# Altium project UWB Wireless Board.PrjPcb
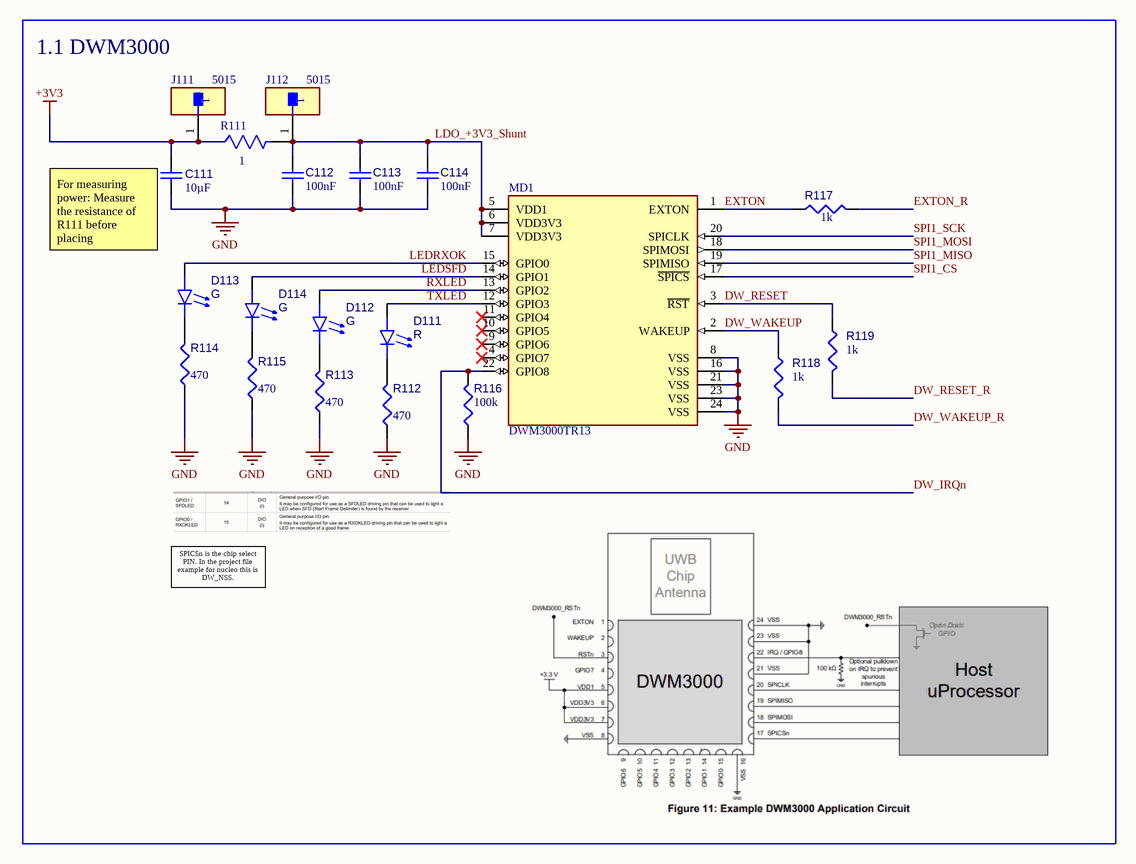
[diagram p0: DWM3000.SchDoc]
4 sheets, 61 parts. Net scope: global (net labels, ports and power ports of the same name join across sheets).
Board file: PCB1.PcbDoc
Sheets:
  DWM3000.SchDoc
  ESP32_S2.SchDoc
  Power Supply.SchDoc
  Peripherals.SchDoc

## Sheet DWM3000.SchDoc
size A4; SheetNumber: 1; SheetTotal: 4

### Parts
C111  value 10µF  [CAPC0603(1608)100_L]  (hidden comment: Capacitor 10µF +/-20% 10V 0603)
C112  value 100nF  [CAPC0402(1005)60_L]  (hidden comment: Capacitor 100nF +/-20% 10V 0402)
C113  value 100nF  [CAPC0402(1005)60_L]  (hidden comment: Capacitor 100nF +/-20% 10V 0402)
C114  value 100nF  [CAPC0402(1005)60_L]  (hidden comment: Capacitor 100nF +/-20% 10V 0402)
D111  R  [WL-SMCW_0603_150060xx75000]
D112  G  [WL-SMCW_0603_150060xx75000]
D113  G  [WL-SMCW_0603_150060xx75000]
D114  G  [WL-SMCW_0603_150060xx75000]
J111  5015  [FP-5015-MFG]
J112  5015  [FP-5015-MFG]
MD1  DWM3000TR13  [FP-DWM3000TR13-MFG]
R111  value 1  [FP-CRCW0603-HPe3-MFG]  (hidden comment: CRCW06031R00FKEAHP)
R112  value 470  [RESC0805(2012)_L]  (hidden comment: Resistor 470R +/-5% 0805 125 mW)
R113  value 470  [RESC0805(2012)_L]  (hidden comment: Resistor 470R +/-5% 0805 125 mW)
R114  value 470  [RESC0805(2012)_L]  (hidden comment: Resistor 470R +/-5% 0805 125 mW)
R115  value 470  [RESC0805(2012)_L]  (hidden comment: Resistor 470R +/-5% 0805 125 mW)
R116  value 100k  [RESC1608X55X25ML10T15]  (hidden comment: Resistor 100k +/-1% 0603 100 mW)
R117  value 1k  [RESC1005X40X25ML10T10]  (hidden comment: Resistor 1k +/-5% 0402 63 mW)
R118  value 1k  [RESC1005X40X25ML10T10]  (hidden comment: Resistor 1k +/-5% 0402 63 mW)
R119  value 1k  [RESC1005X40X25ML10T10]  (hidden comment: Resistor 1k +/-5% 0402 63 mW)

### Blocks framed on the sheet
1.1 DWM3000: C111-C114 D111-D114 J111 J112 MD1 R111-R119

### Nets
+3V3: C111.1 J111.1 R111.1
GND: C111.2 C112.1 C113.1 C114.1 MD1.8(VSS) MD1.16(VSS) MD1.21(VSS) MD1.23(VSS) MD1.24(VSS) R112.1 R113.1 R114.1 R115.1 R116.1
DW_IRQn: MD1.22(GPIO8) R116.2
DW_RESET: MD1.3(~{RST}) R119.1
DW_RESET_R: R119.2
DW_WAKEUP: MD1.2(WAKEUP) R118.1
DW_WAKEUP_R: R118.2
EXTON: MD1.1(EXTON) R117.1
EXTON_R: R117.2
LDO_+3V3_Shunt: C112.2 C113.2 C114.2 J112.1 MD1.5(VDD1) MD1.6(VDD3V3) MD1.7(VDD3V3) R111.2
LEDRXOK: D113.2(A) MD1.15(GPIO0)
LEDSFD: D114.2(A) MD1.14(GPIO1)
RXLED: D112.2(A) MD1.13(GPIO2)
SPI1_CS: MD1.17(~{SPICS})
SPI1_MISO: MD1.19(SPIMISO)
SPI1_MOSI: MD1.18(SPIMOSI)
SPI1_SCK: MD1.20(SPICLK)
TXLED: D111.2(A) MD1.12(GPIO3)
NetD111_1: D111.1(K) R112.2
NetD112_1: D112.1(K) R113.2
NetD113_1: D113.1(K) R114.2
NetD114_1: D114.1(K) R115.2

Not connected (* = marked no-connect by the designer): MD1 4(GPIO7)* 9(GPIO6)* 10(GPIO5)* 11(GPIO4)*

### Notes on the sheet
- (near C111) For measuring power: Measure the resistance of R111 before placing
- SPICSn is the chip select PIN. In the project file example for nucleo this is DW_NSS.

### Library data of the parts
C111 = CMP-001-00075-4: Chip Capacitor, 10µF +/-20%, 10V, 0603, Thickness 1 mm; Tolerance: 10%; Voltage Rating: 10V; Max Operating Temperature: 85°C; Pins: 2; Case/Package: 0603; Mounting Technology: SMT; Min Operating Temperature: -55°C
C112-C114 = CMP-001-00061-3: Chip Capacitor, 100nF +/-20%, 10V, 0402, Thickness 0.6 mm; Tolerance: 20%; Mounting Technology: SMT; Voltage Rating: 10V; Max Operating Temperature: 85°C; Pins: 2; Case/Package: 0402; Min Operating Temperature: -55°C
D111 = CMP-007-00037-1: Single Color LED, Red, Water Clear, 1.1mm; RoHS Compliant: Yes; Max Operating Temperature: 85°C; Min Operating Temperature: -40°C
D112-D114 = CMP-007-00038-1: Single Color LED, Green, Water Clear, 1.1mm; Max Operating Temperature: 85°C; Min Operating Temperature: -40°C; RoHS Compliant: Yes
J111 J112 = CMP-00028-00008-1: Interconnection Device; RoHS Compliant: Yes; Connector Type: Interconnection Device; JESD-609 Code: e4; Contact Finish - Termination: Silver (Ag); Reach SVHC Compliant: Yes
MD1 = CMP-021-00007-1: UWB Transceiver Module; RoHS Compliant: Yes
R111 = CMP-009-00195-1: Fixed Resistor, Metal Glaze/thick Film, 0.33W, 1ohm, 75V, 1% +/-Tol, 100ppm/Cel, Surface Mount, 0603; Package Height: 0.45mm; Temperature Coefficient: 100ppm/°C; Package Length: 1.6mm; Reference Standard: AEC-Q200; Package Width: 0.85mm; Rated Temperature: 70°C; Power: 250mW; Pins: 2; Packaging: Tape and Reel; Package Shape: Rectangular; Mounting Technology: Surface Mount; RoHS Compliant: Yes; Resistor Type: FIXED RESISTOR; Construction: Chip; Technology: METAL GLAZE/THICK FILM; Tolerance: 1%; Max Operating Temperature: 155°C; Termination: Wraparound; Terminal Finish: Nickel; Min Operating Temperature: -55°C; Package Style: SMTMeter; Reach SVHC Compliant: Yes; Case/Package: 0603; Working Voltage: 75V; JESD-609 Code: e3
R112-R115 = CMP-009-00122-3: Chip Resistor, 470 Ohms, +/-5%, 125 mW, -55 to 155 degC, 0805; Tolerance: 5%; Power: 125mW; Max Operating Temperature: 155°C; Case/Package: 0805; Pins: 2; Min Operating Temperature: -55°C
R116 = CMP-009-00023-5: Chip Resistor, 100 KOhm, +/- 1%, 0.1 W, -55 to 155 degC, 0603 (1608 Metric); Voltage Rating: 50V; Power: 100mW; Max Operating Temperature: 155°C; RoHS Compliant: True; Tolerance: 1%; Pins: 2; Case/Package: 0603; Mounting Technology: SM; Min Operating Temperature: -55°C
R117-R119 = CMP-009-00013-5: Chip Resistor, 1 KOhm, +/- 5%, 0.063 W, -55 to 155 degC, 0402 (1005 Metric); Power: 63mW; Tolerance: 5%; Case/Package: 0402; Mounting Technology: SM; Min Operating Temperature: -55°C; Pins: 2; Max Operating Temperature: 155°C; RoHS Compliant: True

## Sheet ESP32_S2.SchDoc
size A2; SheetNumber: 2; SheetTotal: 4
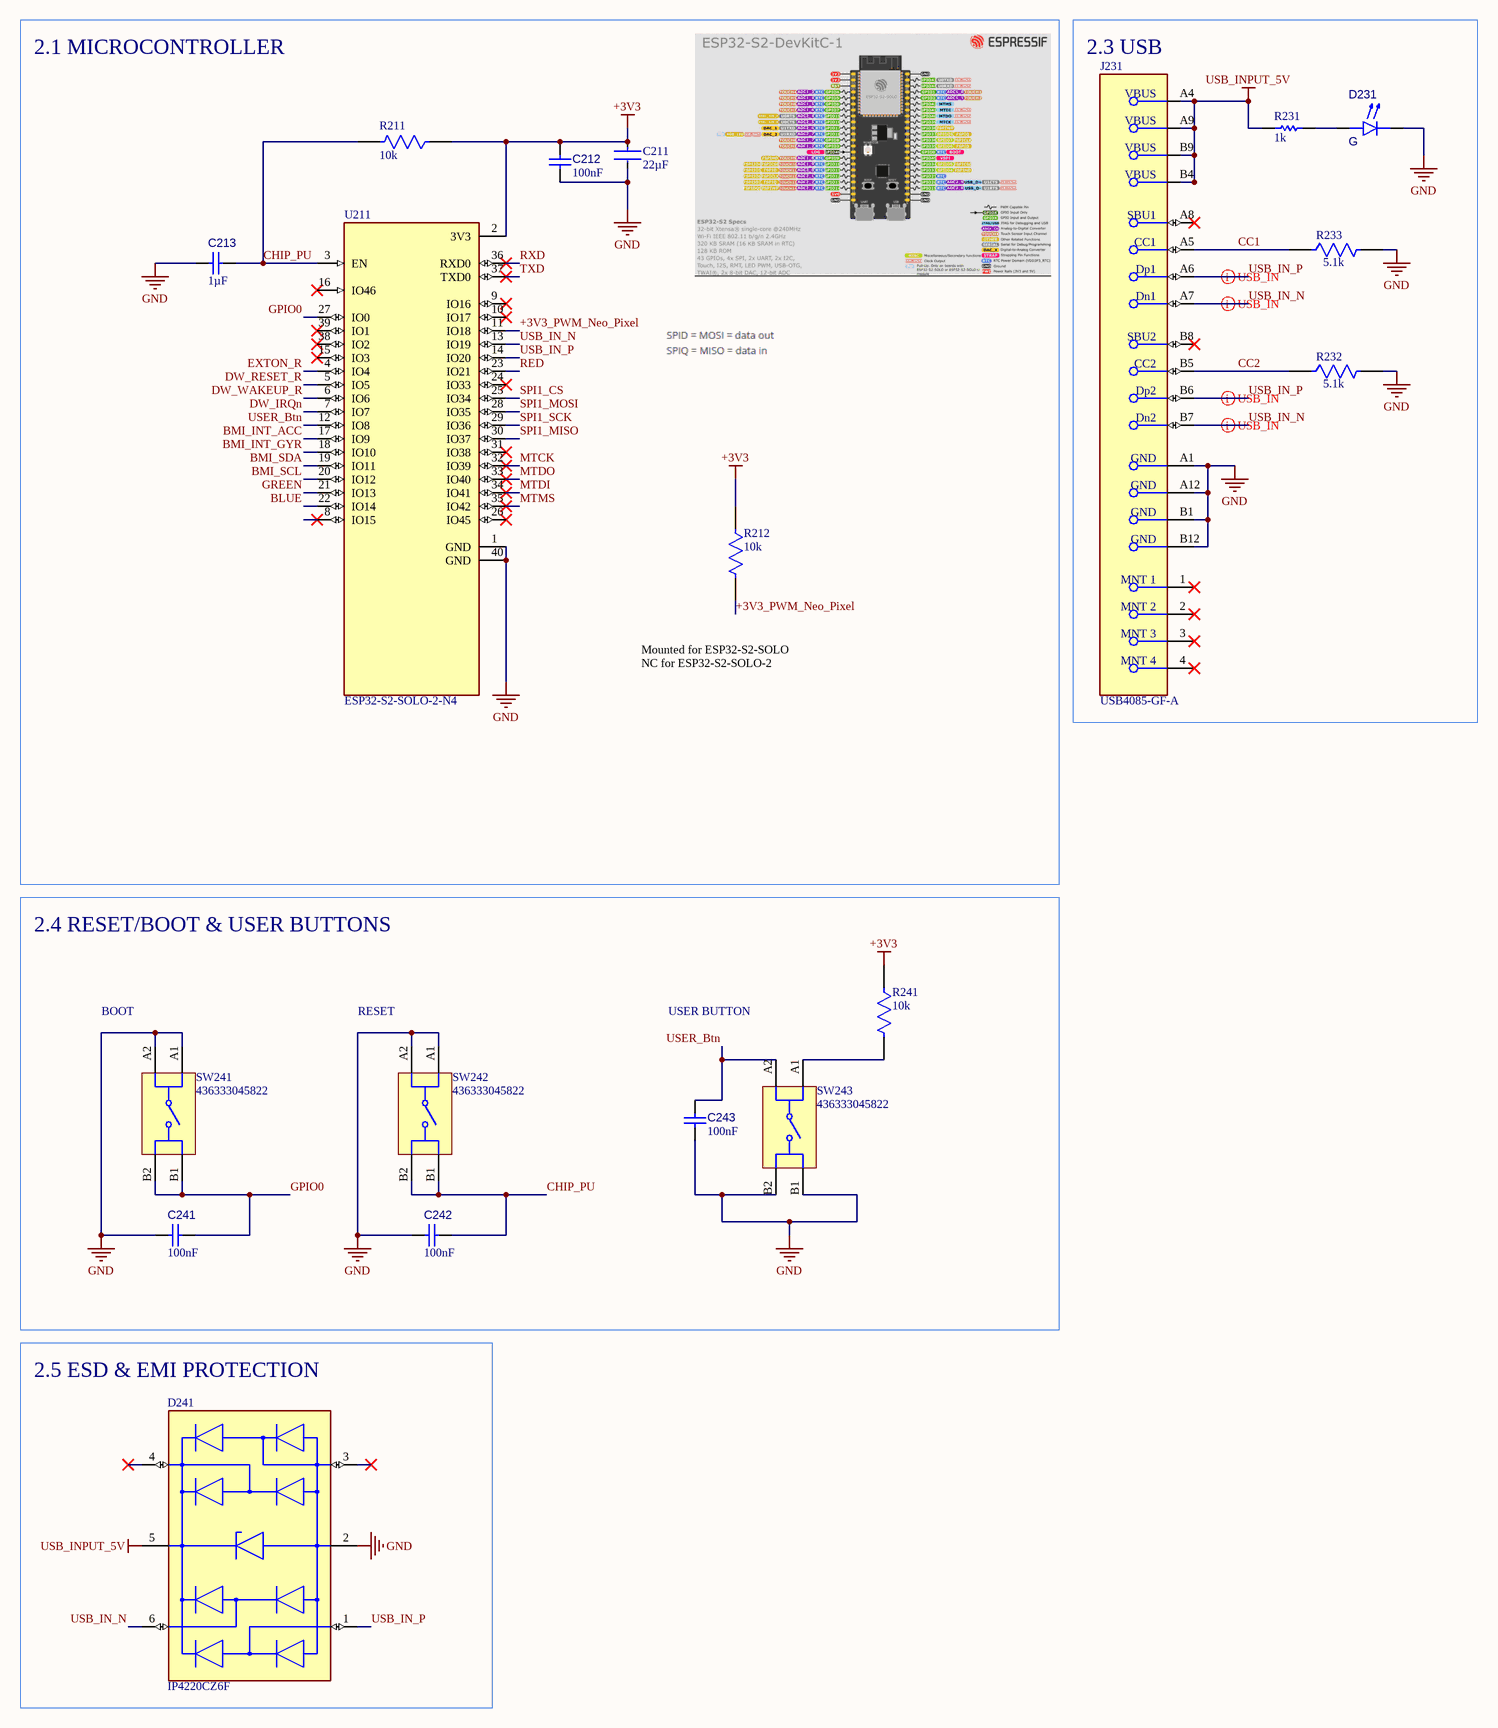
[diagram p1: ESP32_S2.SchDoc]

### Parts
C211  value 22µF  [FP-GRM21B-0_2-e0_2_0_7-MFG]  (hidden comment: GRM21BZ71A226ME15L)
C212  value 100nF  [CAPC0402(1005)60_L]  (hidden comment: Capacitor 100nF +/-20% 10V 0402)
C213  value 1µF  [CAPC0402(1005)60_L]  (hidden comment: Capacitor 1µF +/-20% 10V 0402)
C241  value 100nF  [CAPC1005X56X25LL10T15]  (hidden comment: Capacitor 0.1 uF +/- 5% 16 V 0402)
C242  value 100nF  [CAPC1005X56X25LL10T15]  (hidden comment: Capacitor 0.1 uF +/- 5% 16 V 0402)
C243  value 100nF  [CAPC1005X56X25LL10T15]  (hidden comment: Capacitor 0.1 uF +/- 5% 16 V 0402)
D231  G  [WL-SMCW_0603_150060xx75000]
D241  IP4220CZ6F  [FP-SOT457-IPC_C]
J231  USB4085-GF-A  [FP-USB4085-GF-A-MFG]
R211  value 10k  [FP-RC0402-0_4-MFG]  (hidden comment: RC0402JR-0710KL)
R212  value 10k  [FP-RC0402-0_4-MFG]  (hidden comment: RC0402JR-0710KL)
R231  value 1k  [RESC2013X60X35ML10T20]  (hidden comment: RC0805FR-071KL)
R232  value 5.1k  [FP-RT0402-IPC_B]  (hidden comment: RT0402DRE075K1L)
R233  value 5.1k  [FP-RT0402-IPC_B]  (hidden comment: RT0402DRE075K1L)
R241  value 10k  [FP-RC0402-0_4-MFG]  (hidden comment: RC0402JR-0710KL)
SW241  436333045822  [436333045822]
SW242  436333045822  [436333045822]
SW243  436333045822  [436333045822]
U211  ESP32-S2-SOLO-2-N4  [XCVR_ESP32-S2-SOLO-N4]

### Blocks framed on the sheet
2.1 MICROCONTROLLER: C211-C213 R211 R212 U211
2.3 USB: D231 J231 R231-R233
2.4 RESET/BOOT & USER BUTTONS: C241-C243 R241 SW241-SW243
2.5 ESD & EMI PROTECTION: D241

### Nets
+3V3: C211.1 C212.2 R211.1 R212.1 R241.1 U211.2(3V3)
GND: C211.2 C212.1 C213.2 C241.1 C242.1 C243.1 D231.1(K) D241.2(GND) J231.A1(GND) J231.A12(GND) J231.B1(GND) J231.B12(GND) R232.2 R233.2 SW241.A1 SW241.A2 SW242.A1 SW242.A2 SW243.B1 SW243.B2 U211.1(GND) U211.40(GND)
USB_INPUT_5V: D241.5(VP) J231.A4(VBUS) J231.A9(VBUS) J231.B4(VBUS) J231.B9(VBUS) R231.1
+3V3_PWM_Neo_Pixel: R212.2 U211.11(IO18)
BLUE: U211.22(IO14)
BMI_INT_ACC: U211.17(IO9)
BMI_INT_GYR: U211.18(IO10)
BMI_SCL: U211.20(IO12)
BMI_SDA: U211.19(IO11)
CC1: J231.A5(CC1) R233.1
CC2: J231.B5(CC2) R232.1
CHIP_PU: C213.1 C242.2 R211.2 SW242.B1 SW242.B2 U211.3(EN)
DW_IRQn: U211.7(IO7)
DW_RESET_R: U211.5(IO5)
DW_WAKEUP_R: U211.6(IO6)
EXTON_R: U211.4(IO4)
GPIO0: C241.2 SW241.B1 SW241.B2 U211.27(IO0)
GREEN: U211.21(IO13)
MTCK: U211.32(IO39)
MTDI: U211.34(IO41)
MTDO: U211.33(IO40)
MTMS: U211.35(IO42)
RED: U211.23(IO21)
RXD: U211.36(RXD0)
SPI1_CS: U211.25(IO34)
SPI1_MISO: U211.30(IO37)
SPI1_MOSI: U211.28(IO35)
SPI1_SCK: U211.29(IO36)
TXD: U211.37(TXD0)
USB_IN_N: D241.6(I/O4) J231.A7(Dn1) J231.B7(Dn2) U211.13(IO19)
USB_IN_P: D241.1(I/O1) J231.A6(Dp1) J231.B6(Dp2) U211.14(IO20)
USER_Btn: C243.2 SW243.A2 U211.12(IO8)
NetD231_2: D231.2(A) R231.2
NetR241_2: R241.2 SW243.A1

Not connected (* = marked no-connect by the designer): D241 3(I/O2)* 4(I/O3)*; J231 1(MNT_1)* 2(MNT_2)* 3(MNT_3)* 4(MNT_4)* A8(SBU1)* B8(SBU2)*; U211 8(IO15)* 9(IO16)* 10(IO17)* 15(IO3)* 16(IO46)* 24(IO33)* 26(IO45)* 31(IO38)* 38(IO2)* 39(IO1)*

### Layout directives
differential pair: USB_IN_N, USB_IN_P

### Notes on the sheet
- Mounted for ESP32-S2-SOLO
  NC for ESP32-S2-SOLO-2
- BOOT
- RESET
- USER BUTTON

### Library data of the parts
C211 = CMP-001-00090-1: Ceramic Capacitor, Multilayer, Ceramic, 10V, 20% +Tol, 20% -Tol, X7R, 15% TC, 22uF, Surface Mount, 0805; Min Operating Temperature: -55°C; Mounting Technology: Surface Mount; Case/Package: 0805; Max Operating Temperature: 125°C; Pins: 2; RoHS Compliant: Yes; Capacitor Type: Ceramic
C212 = CMP-001-00061-3: as C112 on sheet DWM3000; Mounting Technology: SMT; Voltage Rating: 10V; Max Operating Temperature: 85°C; Pins: 2; Case/Package: 0402; Min Operating Temperature: -55°C
C213 = CMP-001-00063-3: Chip Capacitor, 1µF +/-20%, 10V, 0402, Thickness 0.6 mm; Tolerance: 10%; Mounting Technology: SMT; Max Operating Temperature: 85°C; Voltage Rating: 10V; Pins: 2; Case/Package: 0402; Min Operating Temperature: -55°C
C241-C243 = CMP-001-00001-6: Chip Capacitor, 0.1 uF, +/- 5%, 16 V, 0402 (1005 Metric); Capacitor Type: Ceramic; Voltage Rating: 16V; Max Operating Temperature: 125°C; Min Operating Temperature: -55°C; Case/Package: 0402; Mounting Technology: SM; Pins: 2; Tolerance: 5%; RoHS Compliant: True
D231 = CMP-007-00038-1: as D112 on sheet DWM3000; Max Operating Temperature: 85°C; Min Operating Temperature: -40°C; RoHS Compliant: Yes
D241 = CMP-004-00031-1: Trans Voltage Suppressor Diode, Unidirectional, 1 Element, Silicon; Min Breakdown Voltage: 6V; Max Breakdown Voltage: 9V; Number of Elements: 1; Package Body Material: Plastic; Package Style: SMALL OUTLINEMeter; Package Shape: Rectangular; JESD-30 Code: R-PDSO-G6; Terminal Form: Gull Wing; Pins: 6; Surface Mount: Yes; RoHS Compliant: Yes; Terminal Position: DUAL; Technology: ZENER; Reach SVHC Compliant: Yes; Diode Element Material: SILICON; Diode Type: TRANS VOLTAGE SUPPRESSOR; Polarity: Unidirectional
J231 = CMP-002-00071-1: USB Connector, 16 Contact(s), Female, Right Angle, Solder Terminal, Receptacle
R211 R212 R241 = CMP-009-00196-1: Fixed Resistor, Metal Glaze/thick Film, 0.0625W, 10000ohm, 50V, 5% +/-Tol, 100ppm/Cel, Surface Mount, 0402; Package Width: 0.5mm; Rated Temperature: 70°C; Power: 62.5mW; Package Height: 0.35mm; Temperature Coefficient: 100ppm/°C; Package Length: 1mm; Additional Feature: LASER TRIMMABLE; Reach SVHC Compliant: Yes; Terminal Finish: Nickel; Package Shape: Rectangular; Package Style: SMTMeter; JESD-609 Code: e3; Tolerance: 5%; Technology: METAL GLAZE/THICK FILM; Case/Package: 0402; Working Voltage: 50V; Termination: Wraparound; Min Operating Temperature: -55°C; Resistor Type: FIXED RESISTOR; Max Operating Temperature: 155°C; Construction: Chip; RoHS Compliant: Yes; Packaging: Tape and Reel; Mounting Technology: Surface Mount; Pins: 2
R231 = CMP-009-00207-1: Fixed Resistor, Metal Glaze/thick Film, 0.125W, 1000ohm, 150V, 1% +/-Tol, 100ppm/Cel, Surface Mount, 0805; Temperature Coefficient: 100ppm/°C; Package Height: 0.5mm; Power: 125mW; Rated Temperature: 70°C; Package Width: 1.25mm; Package Length: 2mm; Additional Feature: LASER TRIMMABLE; Technology: METAL GLAZE/THICK FILM; RoHS Compliant: Yes; Construction: Chip; Case/Package: 0805; Resistor Type: FIXED RESISTOR; JESD-609 Code: e3; Packaging: Tape and Reel; Tolerance: 1%; Reach SVHC Compliant: Yes; Max Operating Temperature: 155°C; Terminal Finish: Nickel; Min Operating Temperature: -55°C; Package Style: SMTMeter; Mounting Technology: Surface Mount; Working Voltage: 150V; Pins: 2; Package Shape: Rectangular; Termination: Wraparound
R232 R233 = CMP-009-00198-1: Fixed Resistor, Thin Film, 0.0625W, 5100ohm, 50V, 0.5% +/-Tol, 50ppm/Cel, Surface Mount, 0402; Rated Temperature: 70°C; Power: 62.5mW; Additional Feature: HIGH PRECISION; Package Height: 0.3mm; Temperature Coefficient: 50ppm/°C; Package Length: 1mm; Package Width: 0.5mm; Packaging: Tape and Reel; Construction: Chip; Technology: THIN FILM; Working Voltage: 50V; Min Operating Temperature: -55°C; Pins: 2; Case/Package: 0402; Mounting Technology: Surface Mount; Resistor Type: FIXED RESISTOR; RoHS Compliant: Yes; Termination: Wraparound; Package Style: SMTMeter; Max Operating Temperature: 155°C; Tolerance: 0.5%; Reach SVHC Compliant: Yes
SW241-SW243 = CMP-011-00016-1: Keypad Switch, 1 Switches, SPST, Momentary-tactile, 0.05A, 12VDC, 2.65N, Solder Terminal, Surface Mount-right Angle; Body Color: Black; Body Breadth: 3.5inch; End Contact Material: Stainless Steel; Solderability: REFLOW; Contact Resistance: 0.1mR; Actuator Type: STEM; Contact Function: On-Off; End Contact Plating: Silver; Dielectric Withstand Volts: 250VACV; Actuator Material: Polyamide; Contact DC Max Rating R Load: .05A@12VDC; Electrical Life: 100000Cycles; Contact Voltage(DC)-Max: 12V; Body Length or Diameter: 4.7mm; Actuator Length: 0.039inch; Insulation Resistance: 100MR; Circuit Configuration: 1X1; Number of Switches: 1; Body Height: 1.65mm; Contact Current(DC)-Max: 50mA; Terminal Material: Copper Alloy; Min Operating Temperature: -40°C; Switch Type: Keypad; Switch Action: MOMENTARY-TACTILE; Max Operating Temperature: 85°C; Packaging: Tape and Reel; Switch Function: SPST; Center Contact Plating: Silver; Contact Material: Stainless Steel; Mounting Technology: Surface Mount; Reach SVHC Compliant: Yes; Termination: Solder; RoHS Compliant: Yes; Housing Material: Stainless Steel; Insulation Material: Polyamide; Operating Force-Max: 2.65N
U211 = CMP-009-000000-5: SMD Module, ESP32-S2, 4 mb Spi F; MF: Espressif Systems; Source: ESP32-S2-SOLO-N4.SchLib; Package: None; Pin Count: 49; Design Item ID: ESP32-S2-SOLO-N4; Value: *; Component Type: Standard; MP: ESP32-S2-SOLO-N4; Check_prices: https://www.snapeda.com/parts/ESP32-S2-SOLO-N4/Espressif+Systems/view-part/?ref=eda; SnapEDA_Link: https://www.snapeda.com/parts/ESP32-S2-SOLO-N4/Espressif+Systems/view-part/?ref=snap

## Sheet Power Supply.SchDoc
size A3; SheetNumber: 3; SheetTotal: 4
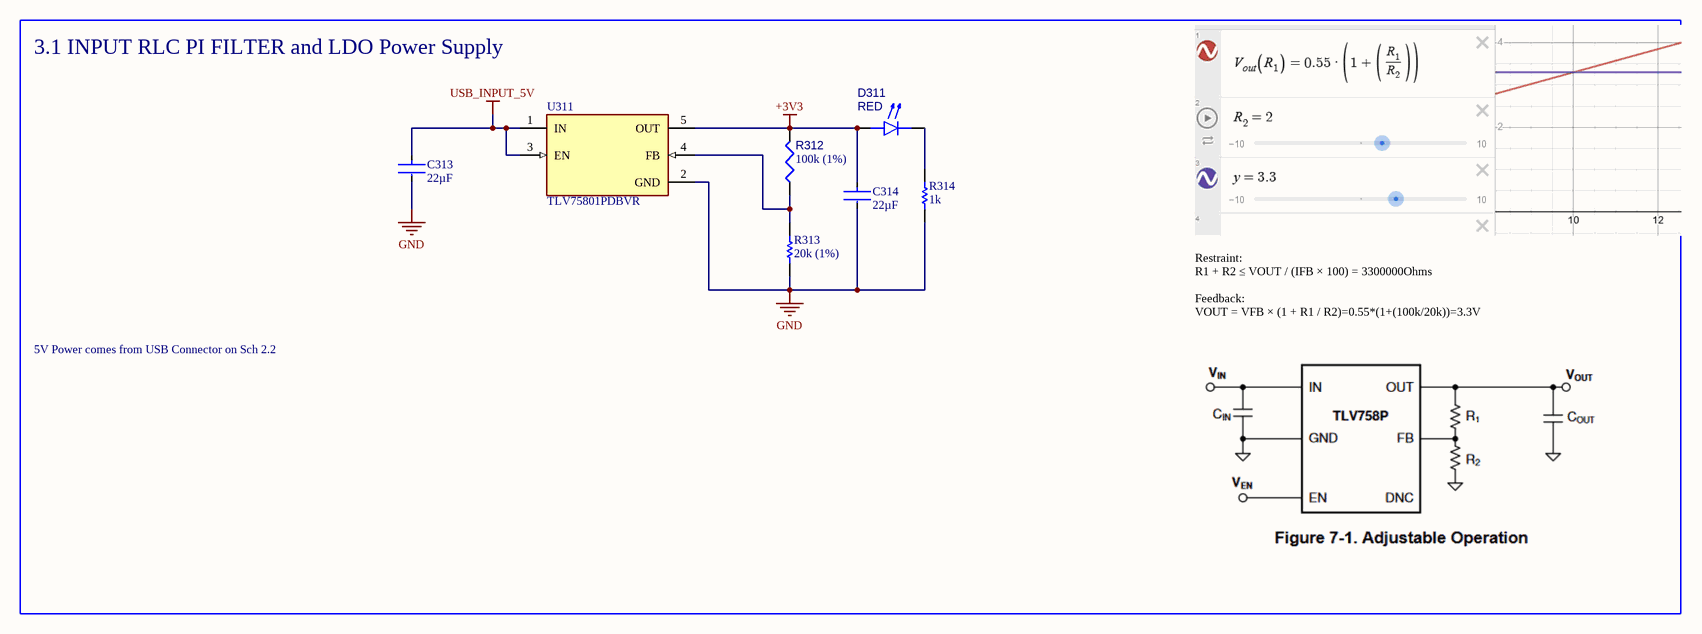
[diagram p2: Power Supply.SchDoc]

### Parts
C313  value 22µF  [FP-GRM21B-0_2-e0_2_0_7-MFG]  (hidden comment: GRM21BZ71A226ME15L)
C314  value 22µF  [FP-GRM21B-0_2-e0_2_0_7-MFG]  (hidden comment: GRM21BZ71A226ME15L)
D311  RED  [WL-SMCW_0603_150060xx75000]
R312  value 100k (1%)  [RESC1608X55X25ML10T15]  (hidden comment: Resistor 100k +/-1% 0603 100 mW)
R313  value 20k (1%)  [RESC1608X55X25ML10T15]  (hidden comment: RC0603FR-1320KL)
R314  value 1k  [RESC2013X60X35ML10T20]  (hidden comment: RC0805FR-071KL)
U311  TLV75801PDBVR  [FP-DBV0005A-IPC_B]

### Nets
+3V3: C314.1 D311.2(A) R312.2 U311.5(OUT)
GND: C313.2 C314.2 R313.2 R314.1 U311.2(GND)
USB_INPUT_5V: C313.1 U311.1(IN) U311.3(EN)
NetD311_1: D311.1(K) R314.2
NetR312_1: R312.1 R313.1 U311.4(FB)

### Notes on the sheet
- 3.1 INPUT RLC PI FILTER and LDO Power Supply
- Restraint:
  R1 + R2 ≤ VOUT / (IFB × 100) = 3300000Ohms
- 5V Power comes from USB Connector on Sch 2.2
- Feedback:
  VOUT = VFB × (1 + R1 / R2)=0.55*(1+(100k/20k))=3.3V

### Library data of the parts
C313 C314 = CMP-001-00090-1: as C211 on sheet ESP32_S2; Min Operating Temperature: -55°C; Mounting Technology: Surface Mount; Case/Package: 0805; Max Operating Temperature: 125°C; Pins: 2; RoHS Compliant: Yes; Capacitor Type: Ceramic
D311 = CMP-007-00037-1: as D111 on sheet DWM3000; RoHS Compliant: Yes; Max Operating Temperature: 85°C; Min Operating Temperature: -40°C
R312 = CMP-009-00023-5: as R116 on sheet DWM3000; Max Operating Temperature: 155°C; RoHS Compliant: True; Tolerance: 1%; Pins: 2; Case/Package: 0603; Mounting Technology: SM; Min Operating Temperature: -55°C
R313 = CMP-009-00200-1: Fixed Resistor, Metal Glaze/thick Film, 0.1W, 20000ohm, 75V, 1% +/-Tol, 100ppm/Cel, Surface Mount, 0603; Power: 100mW; Package Width: 0.8mm; Package Length: 1.6mm; Package Height: 0.45mm; Rated Temperature: 70°C; Additional Feature: LASER TRIMMABLE; Temperature Coefficient: 100ppm/°C; Working Voltage: 75V; Technology: METAL GLAZE/THICK FILM; RoHS Compliant: Yes; Package Style: SMTMeter; Max Operating Temperature: 155°C; Termination: Wraparound; JESD-609 Code: e3; Case/Package: 0603; Mounting Technology: Surface Mount; Pins: 2; Tolerance: 1%; Terminal Finish: Nickel; Package Shape: Rectangular; Min Operating Temperature: -55°C; Reach SVHC Compliant: Yes; Construction: Chip; Packaging: Tape and Reel; Resistor Type: FIXED RESISTOR
R314 = CMP-009-00207-1: as R231 on sheet ESP32_S2; Technology: METAL GLAZE/THICK FILM; RoHS Compliant: Yes; Construction: Chip; Case/Package: 0805; Resistor Type: FIXED RESISTOR; JESD-609 Code: e3; Packaging: Tape and Reel; Tolerance: 1%; Reach SVHC Compliant: Yes; Max Operating Temperature: 155°C; Terminal Finish: Nickel; Min Operating Temperature: -55°C; Package Style: SMTMeter; Mounting Technology: Surface Mount; Working Voltage: 150V; Pins: 2; Package Shape: Rectangular; Termination: Wraparound
U311 = CMP-019-00054-1: Adjustable Positive LDO Regulator, 0.55V Min, 5.5V Max, PDSO5

## Sheet Peripherals.SchDoc
size B; SheetNumber: 4; SheetTotal: 4
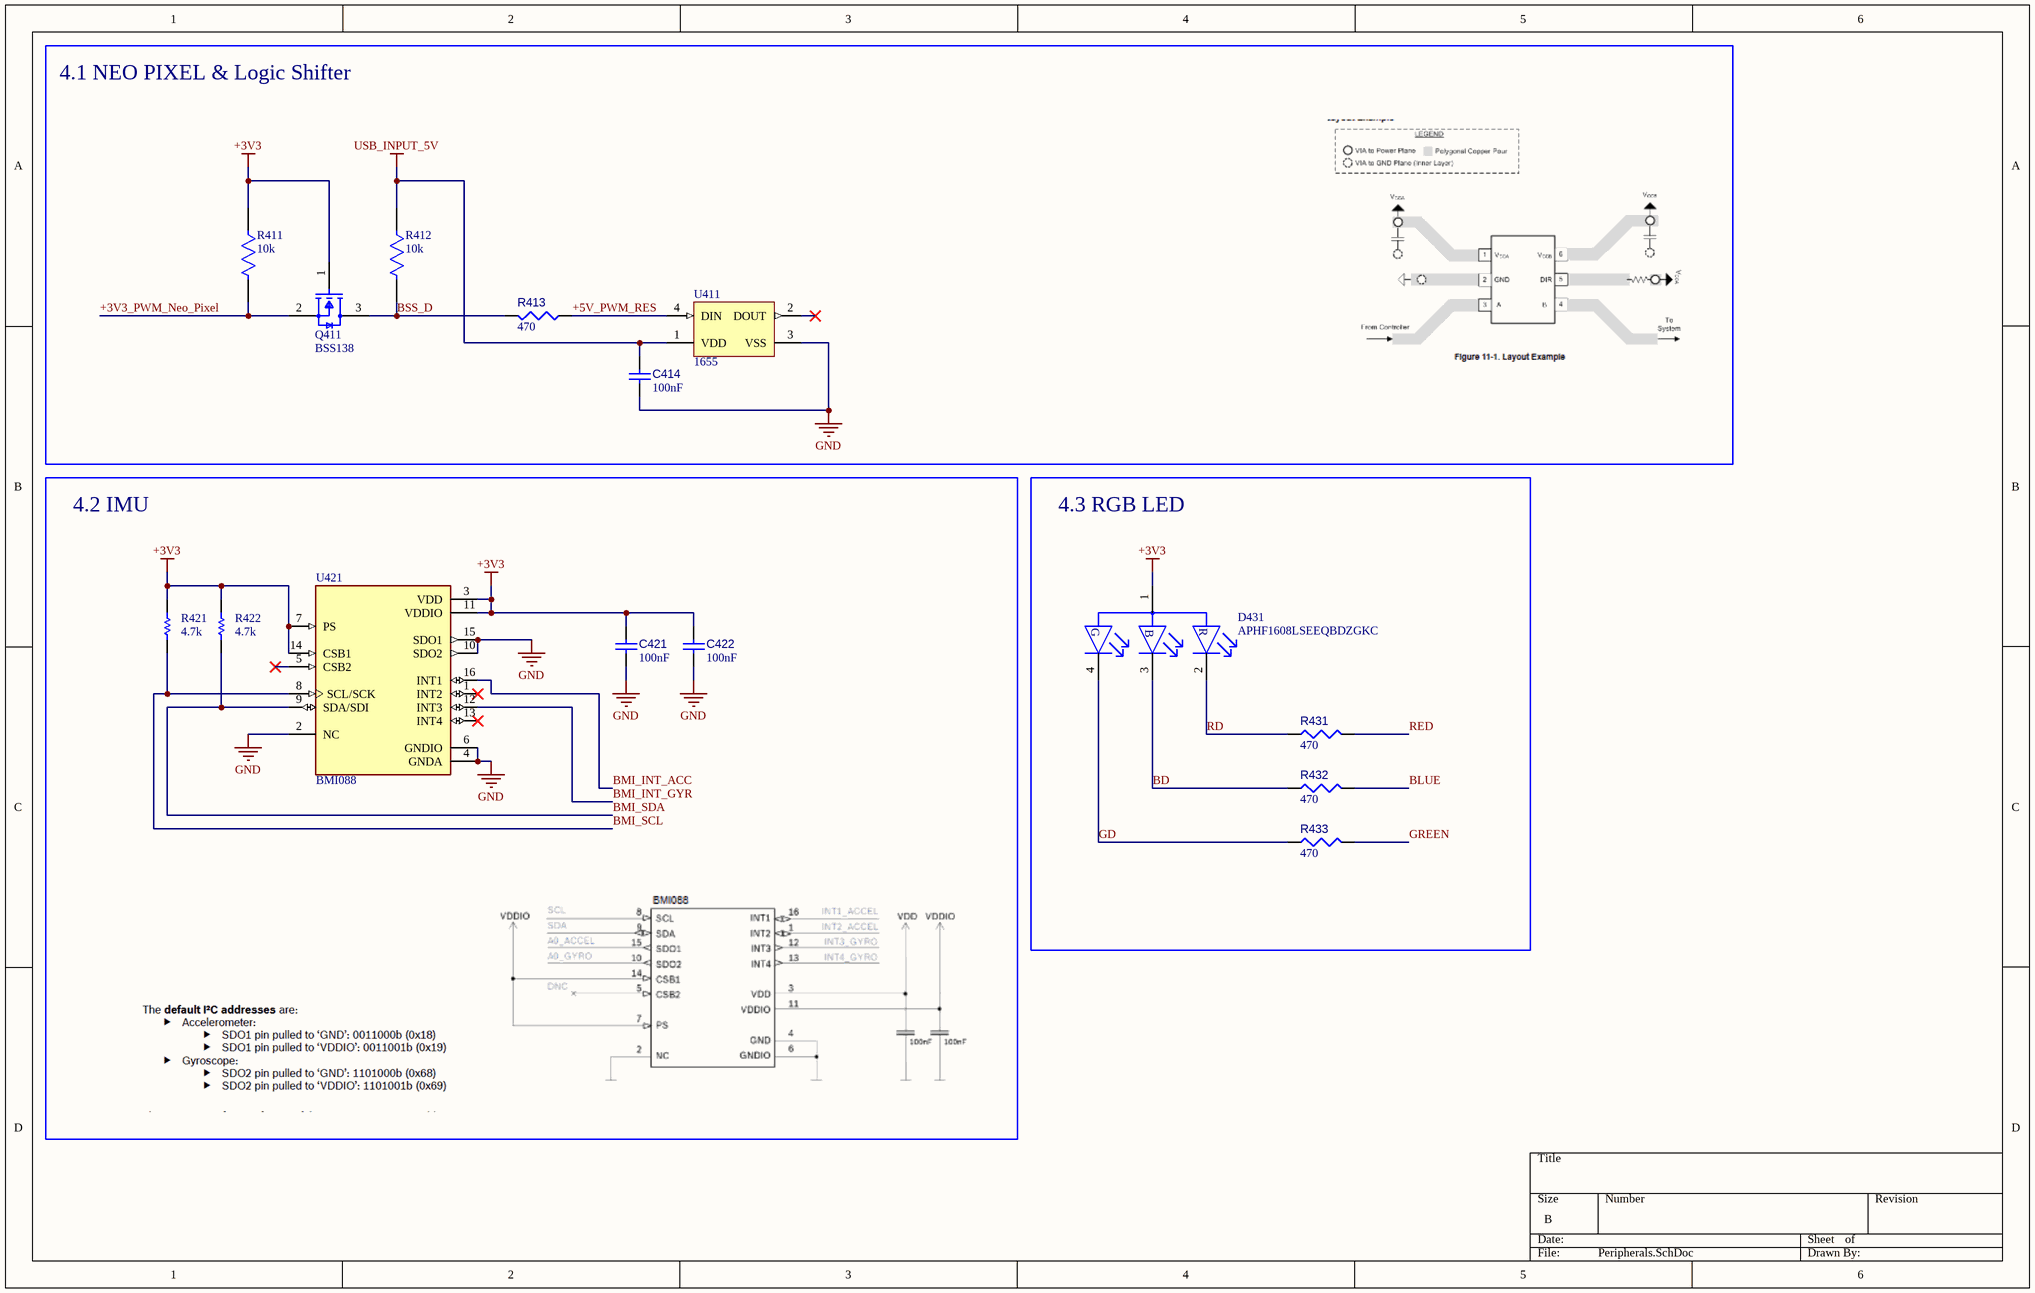
[diagram p3: Peripherals.SchDoc]

### Parts
C414  value 100nF  [CAPC0402(1005)60_L]  (hidden comment: Capacitor 100nF +/-20% 10V 0402)
C421  value 100nF  [CAPC0402(1005)60_L]  (hidden comment: Capacitor 100nF +/-20% 10V 0402)
C422  value 100nF  [CAPC0402(1005)60_L]  (hidden comment: Capacitor 100nF +/-20% 10V 0402)
D431  APHF1608LSEEQBDZGKC  [FP-APHF1608LSEEQBDZGKC-MFG]
Q411  BSS138  [FP-318-08-IPC_B]
R411  value 10k  [FP-RC0402-0_4-MFG]  (hidden comment: RC0402JR-0710KL)
R412  value 10k  [FP-RC0402-0_4-MFG]  (hidden comment: RC0402JR-0710KL)
R413  value 470  [RESC0805(2012)_L]  (hidden comment: Resistor 470R +/-5% 0805 125 mW)
R421  value 4.7k  [RESC1609X50X30NL10T20]  (hidden comment: CRCW06034K70FKTA)
R422  value 4.7k  [RESC1609X50X30NL10T20]  (hidden comment: CRCW06034K70FKTA)
R431  value 470  [RESC0805(2012)_L]  (hidden comment: Resistor 470R +/-5% 0805 125 mW)
R432  value 470  [RESC0805(2012)_L]  (hidden comment: Resistor 470R +/-5% 0805 125 mW)
R433  value 470  [RESC0805(2012)_L]  (hidden comment: Resistor 470R +/-5% 0805 125 mW)
U411  1655  [ADA-RGB-1655_V]
U421  BMI088  [PQFN50P450X300X100-16N]

### Blocks framed on the sheet
4.1 NEO PIXEL & Logic Shifter: C414 Q411 R411-R413 U411
4.2 IMU: C421 C422 R421 R422 U421
4.3 RGB LED: D431 R431-R433

### Nets
+3V3: C421.2 C422.2 D431.1(COMMON_ANODE) Q411.1(G) R411.1 R421.2 R422.2 U421.3(VDD) U421.7(PS) U421.11(VDDIO) U421.14(CSB1)
GND: C414.1 C421.1 C422.1 U411.3(VSS) U421.2(NC) U421.4(GNDA) U421.6(GNDIO) U421.10(SDO2) U421.15(SDO1)
USB_INPUT_5V: C414.2 R412.1 U411.1(VDD)
+3V3_PWM_Neo_Pixel: Q411.2(S) R411.2
+5V_PWM_RES: R413.1 U411.4(DIN)
BD: D431.3(Blue_C) R432.1
BLUE: R432.2
BMI_INT_ACC: U421.16(INT1)
BMI_INT_GYR: U421.12(INT3)
BMI_SCL: R421.1 U421.8(SCL/SCK)
BMI_SDA: R422.1 U421.9(SDA/SDI)
BSS_D: Q411.3(D) R412.2 R413.2
GD: D431.4(Green_C) R433.1
GREEN: R433.2
RD: D431.2(Red_C) R431.1
RED: R431.2

Not connected (* = marked no-connect by the designer): U411 2(DOUT)*; U421 1(INT2)* 5(CSB2)* 13(INT4)*

### Notes on the sheet
- (in symbol CMP-44529-000066-1) G; B; R

### Library data of the parts
C414 C421 C422 = CMP-001-00061-3: as C112 on sheet DWM3000; Mounting Technology: SMT; Voltage Rating: 10V; Max Operating Temperature: 85°C; Pins: 2; Case/Package: 0402; Min Operating Temperature: -55°C
D431 = CMP-44529-000066-1: LED RGB CLEAR 4SMD; Test Current: 2mA; Lens Color: Colorless; Lens Size: 0.8mm; Viewing Angle: 140°; Element Configuration: Common Anode; Forward Voltage: 2.65V; Luminous Intensity: 10mcd; Color: Blue; Lens Style: Flat; Dominant Wavelength: 465nm; Packaging: Tape and Reel; Mount: Surface Mount; Length: 1.6mm; RoHS Compliant: Yes; Lens Transparency: Clear; Width: 0.8mm; Case/Package: SMD/SMT; Height: 0.6mm
Q411 = CMP-013-00036-1: Small Signal Field-Effect Transistor, 0.22A I(D), 50V, 1-Element, N-Channel, Silicon, Metal-oxide Semiconductor FET; RoHS Compliant: Yes
R411 R412 = CMP-009-00196-1: as R211 on sheet ESP32_S2; Reach SVHC Compliant: Yes; Terminal Finish: Nickel; Package Shape: Rectangular; Package Style: SMTMeter; JESD-609 Code: e3; Tolerance: 5%; Technology: METAL GLAZE/THICK FILM; Case/Package: 0402; Working Voltage: 50V; Termination: Wraparound; Min Operating Temperature: -55°C; Resistor Type: FIXED RESISTOR; Max Operating Temperature: 155°C; Construction: Chip; RoHS Compliant: Yes; Packaging: Tape and Reel; Mounting Technology: Surface Mount; Pins: 2
R413 R431-R433 = CMP-009-00122-3: as R112 on sheet DWM3000; Max Operating Temperature: 155°C; Case/Package: 0805; Pins: 2; Min Operating Temperature: -55°C
R421 R422 = CMP-009-00191-1: Fixed Resistor, Metal Glaze/thick Film, 0.1W, 4700ohm, 75V, 1% +/-Tol, 100ppm/Cel, Surface Mount, 0603; Rated Temperature: 70°C; Reference Standard: AEC-Q200; Package Width: 0.85mm; Power: 100mW; Package Length: 1.55mm; Temperature Coefficient: 100ppm/°C; Package Height: 0.45mm; Min Operating Temperature: -55°C; Max Operating Temperature: 155°C; Technology: METAL GLAZE/THICK FILM; Mounting Technology: Surface Mount; Package Style: SMTMeter; Termination: Wraparound; Case/Package: 0603; Pins: 2; JESD-609 Code: e0; Package Shape: Rectangular; Reach SVHC Compliant: No; Construction: Chip; Working Voltage: 75V; Terminal Finish: Nickel; Packaging: Tape and Reel; Tolerance: 1%; Resistor Type: FIXED RESISTOR; RoHS Compliant: No
U411 = CMP-007-00044-1: WS2812B 5050 RGB LED WITH INTEGRATED DRIVER CHIP PACK OF 10
U421 = CMP-003-000000-2: BMI088 Series 3.6 V 6 Axis Digital Output Accelerometer Motion Sensor - LGA-16; Component Type: Standard; Price: None; MP: BMI088; Design Item ID: BMI088; Source: BMI088.SchLib; Package: None; Pin Count: 16; Value: *; Availability: Unavailable

## Nets that join several sheets
+3V3: DWM3000 (C111.1 J111.1 R111.1), ESP32_S2 (6 pins), Power Supply (C314.1 D311.2 R312.2 U311.5), Peripherals (11 pins)
GND: DWM3000 (14 pins), ESP32_S2 (22 pins), Power Supply (5 pins), Peripherals (9 pins)
USB_INPUT_5V: ESP32_S2 (6 pins), Power Supply (C313.1 U311.1 U311.3), Peripherals (C414.2 R412.1 U411.1)
+3V3_PWM_Neo_Pixel: ESP32_S2 (R212.2 U211.11), Peripherals (Q411.2 R411.2)
BLUE: ESP32_S2 (U211.22), Peripherals (R432.2)
BMI_INT_ACC: ESP32_S2 (U211.17), Peripherals (U421.16)
BMI_INT_GYR: ESP32_S2 (U211.18), Peripherals (U421.12)
BMI_SCL: ESP32_S2 (U211.20), Peripherals (R421.1 U421.8)
BMI_SDA: ESP32_S2 (U211.19), Peripherals (R422.1 U421.9)
DW_IRQn: DWM3000 (MD1.22 R116.2), ESP32_S2 (U211.7)
DW_RESET_R: DWM3000 (R119.2), ESP32_S2 (U211.5)
DW_WAKEUP_R: DWM3000 (R118.2), ESP32_S2 (U211.6)
EXTON_R: DWM3000 (R117.2), ESP32_S2 (U211.4)
GREEN: ESP32_S2 (U211.21), Peripherals (R433.2)
RED: ESP32_S2 (U211.23), Peripherals (R431.2)
SPI1_CS: DWM3000 (MD1.17), ESP32_S2 (U211.25)
SPI1_MISO: DWM3000 (MD1.19), ESP32_S2 (U211.30)
SPI1_MOSI: DWM3000 (MD1.18), ESP32_S2 (U211.28)
SPI1_SCK: DWM3000 (MD1.20), ESP32_S2 (U211.29)